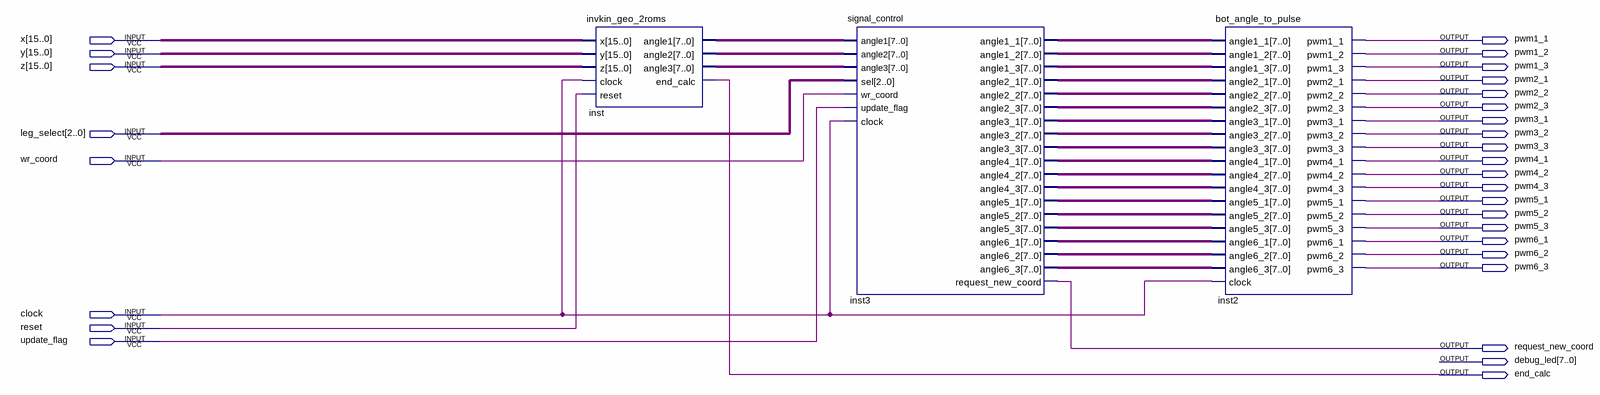
[diagram p0: schematic sheet]
// Quartus schematic full_bot_3.bdf as structural Verilog: 3 symbols, 29 pins
module full_bot_3 (
  input  [15:0] x,
  input  [15:0] y,
  input  [15:0] z,
  input  [2:0] leg_select,
  input  wr_coord,
  input  clock,
  input  reset,
  input  update_flag,
  output pwm1_1,
  output pwm1_2,
  output pwm1_3,
  output pwm2_1,
  output pwm2_2,
  output pwm2_3,
  output pwm3_1,
  output pwm3_2,
  output pwm3_3,
  output pwm4_1,
  output pwm4_2,
  output pwm4_3,
  output pwm5_1,
  output pwm5_2,
  output pwm5_3,
  output pwm6_1,
  output pwm6_2,
  output pwm6_3,
  output request_new_coord,
  output [7:0] debug_led,
  output end_calc
);

  wire [7:0] inst3_angle1_1, inst3_angle1_2, inst3_angle1_3, inst3_angle2_1, inst3_angle2_2, inst3_angle2_3,
       inst3_angle3_1, inst3_angle3_2, inst3_angle3_3, inst3_angle4_1, inst3_angle4_2, inst3_angle4_3,
       inst3_angle5_1, inst3_angle5_2, inst3_angle5_3, inst3_angle6_1, inst3_angle6_2, inst3_angle6_3,
       inst_angle1, inst_angle2, inst_angle3;

  invkin_geo_2roms inst (
    .x(x), .y(y), .z(z), .clock(clock), .reset(reset), .angle1(inst_angle1), .angle2(inst_angle2),
    .angle3(inst_angle3), .end_calc(end_calc));
  signal_control inst3 (
    .angle1(inst_angle1), .angle2(inst_angle2), .angle3(inst_angle3), .sel(leg_select), .wr_coord(wr_coord),
    .update_flag(update_flag), .clock(clock), .angle1_1(inst3_angle1_1), .angle1_2(inst3_angle1_2),
    .angle1_3(inst3_angle1_3), .angle2_1(inst3_angle2_1), .angle2_2(inst3_angle2_2),
    .angle2_3(inst3_angle2_3), .angle3_1(inst3_angle3_1), .angle3_2(inst3_angle3_2),
    .angle3_3(inst3_angle3_3), .angle4_1(inst3_angle4_1), .angle4_2(inst3_angle4_2),
    .angle4_3(inst3_angle4_3), .angle5_1(inst3_angle5_1), .angle5_2(inst3_angle5_2),
    .angle5_3(inst3_angle5_3), .angle6_1(inst3_angle6_1), .angle6_2(inst3_angle6_2),
    .angle6_3(inst3_angle6_3), .request_new_coord(request_new_coord));
  bot_angle_to_pulse inst2 (
    .angle1_1(inst3_angle1_1), .angle1_2(inst3_angle1_2), .angle1_3(inst3_angle1_3),
    .angle2_1(inst3_angle2_1), .angle2_2(inst3_angle2_2), .angle2_3(inst3_angle2_3),
    .angle3_1(inst3_angle3_1), .angle3_2(inst3_angle3_2), .angle3_3(inst3_angle3_3),
    .angle4_1(inst3_angle4_1), .angle4_2(inst3_angle4_2), .angle4_3(inst3_angle4_3),
    .angle5_1(inst3_angle5_1), .angle5_2(inst3_angle5_2), .angle5_3(inst3_angle5_3),
    .angle6_1(inst3_angle6_1), .angle6_2(inst3_angle6_2), .angle6_3(inst3_angle6_3), .clock(clock),
    .pwm1_1(pwm1_1), .pwm1_2(pwm1_2), .pwm1_3(pwm1_3), .pwm2_1(pwm2_1), .pwm2_2(pwm2_2), .pwm2_3(pwm2_3),
    .pwm3_1(pwm3_1), .pwm3_2(pwm3_2), .pwm3_3(pwm3_3), .pwm4_1(pwm4_1), .pwm4_2(pwm4_2), .pwm4_3(pwm4_3),
    .pwm5_1(pwm5_1), .pwm5_2(pwm5_2), .pwm5_3(pwm5_3), .pwm6_1(pwm6_1), .pwm6_2(pwm6_2), .pwm6_3(pwm6_3));
endmodule
